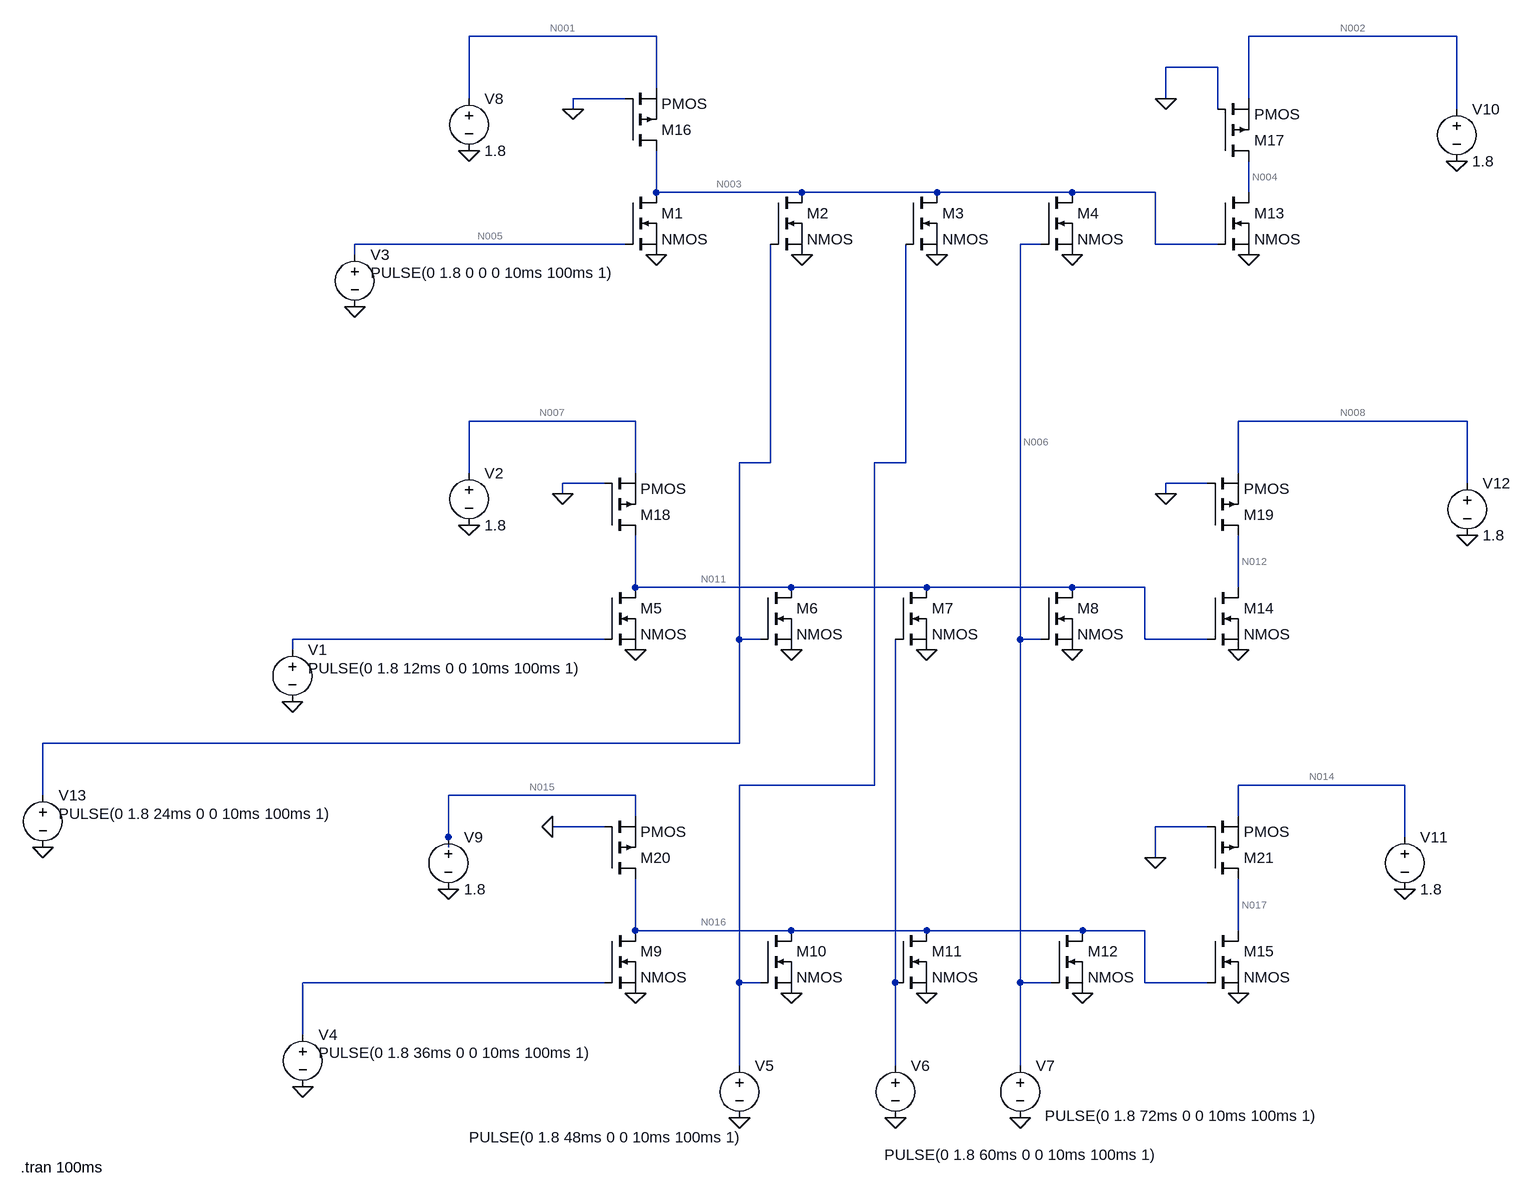
[diagram p0: schematic nmosNF.asc]
nmosNF.asc, the LTspice schematic file:
Version 4
SHEET 1 1140 1792
WIRE -1760 -256 -2048 -256
WIRE -528 -256 -848 -256
WIRE -896 -208 -976 -208
WIRE -1760 -176 -1760 -256
WIRE -2048 -160 -2048 -256
WIRE -1808 -160 -1888 -160
WIRE -976 -160 -976 -208
WIRE -848 -160 -848 -256
WIRE -1888 -144 -1888 -160
WIRE -896 -144 -896 -208
WIRE -528 -144 -528 -256
WIRE -1760 -16 -1760 -80
WIRE -1536 -16 -1760 -16
WIRE -1328 -16 -1536 -16
WIRE -1120 -16 -1328 -16
WIRE -992 -16 -1120 -16
WIRE -848 -16 -848 -64
WIRE -1808 64 -2224 64
WIRE -1168 64 -1200 64
WIRE -992 64 -992 -16
WIRE -896 64 -992 64
WIRE -2224 80 -2224 64
WIRE -1792 336 -2048 336
WIRE -512 336 -864 336
WIRE -1584 400 -1584 64
WIRE -1584 400 -1632 400
WIRE -1376 400 -1376 64
WIRE -1376 400 -1424 400
WIRE -2048 416 -2048 336
WIRE -1792 416 -1792 336
WIRE -864 416 -864 336
WIRE -1840 432 -1904 432
WIRE -912 432 -976 432
WIRE -512 432 -512 336
WIRE -1904 448 -1904 432
WIRE -976 448 -976 432
WIRE -1792 592 -1792 512
WIRE -1552 592 -1792 592
WIRE -1344 592 -1552 592
WIRE -1120 592 -1344 592
WIRE -1008 592 -1120 592
WIRE -864 592 -864 512
WIRE -1792 608 -1792 592
WIRE -1840 672 -2320 672
WIRE -1632 672 -1632 400
WIRE -1600 672 -1632 672
WIRE -1200 672 -1200 64
WIRE -1168 672 -1200 672
WIRE -1008 672 -1008 592
WIRE -912 672 -1008 672
WIRE -2320 688 -2320 672
WIRE -1632 832 -1632 672
WIRE -1632 832 -2704 832
WIRE -1424 896 -1424 400
WIRE -1424 896 -1632 896
WIRE -608 896 -864 896
WIRE -2704 912 -2704 832
WIRE -1792 912 -2080 912
WIRE -1792 944 -1792 912
WIRE -864 944 -864 896
WIRE -1840 960 -1920 960
WIRE -912 960 -992 960
WIRE -2080 976 -2080 912
WIRE -608 976 -608 896
WIRE -2080 992 -2080 976
WIRE -992 1008 -992 960
WIRE -1792 1120 -1792 1040
WIRE -1552 1120 -1792 1120
WIRE -1344 1120 -1552 1120
WIRE -1104 1120 -1344 1120
WIRE -1008 1120 -1104 1120
WIRE -864 1120 -864 1040
WIRE -1840 1200 -2304 1200
WIRE -1632 1200 -1632 896
WIRE -1600 1200 -1632 1200
WIRE -1392 1200 -1392 672
WIRE -1200 1200 -1200 672
WIRE -1152 1200 -1200 1200
WIRE -1008 1200 -1008 1120
WIRE -912 1200 -1008 1200
WIRE -2304 1280 -2304 1200
WIRE -1632 1328 -1632 1200
WIRE -1392 1328 -1392 1200
WIRE -1200 1328 -1200 1200
FLAG -2048 -80 0
FLAG -2224 160 0
FLAG -2048 496 0
FLAG -2320 768 0
FLAG -2704 992 0
FLAG -2080 1056 0
FLAG -2304 1360 0
FLAG -1792 1216 0
FLAG -1632 1408 0
FLAG -1552 1216 0
FLAG -1392 1408 0
FLAG -1200 1408 0
FLAG -1104 1216 0
FLAG -1344 1216 0
FLAG -864 1216 0
FLAG -608 1056 0
FLAG -512 512 0
FLAG -528 -64 0
FLAG -848 80 0
FLAG -1120 80 0
FLAG -1328 80 0
FLAG -1536 80 0
FLAG -1760 80 0
FLAG -1792 688 0
FLAG -1552 688 0
FLAG -1344 688 0
FLAG -1120 688 0
FLAG -1888 -144 0
FLAG -976 -160 0
FLAG -1904 448 0
FLAG -976 448 0
FLAG -1920 960 0
FLAG -992 1008 0
FLAG -864 688 0
SYMBOL nmos -1808 -16 R0
SYMATTR InstName M1
SYMBOL nmos -1584 -16 R0
SYMATTR InstName M2
SYMBOL nmos -1376 -16 R0
SYMATTR InstName M3
SYMBOL nmos -1168 -16 R0
SYMATTR InstName M4
SYMBOL nmos -1840 592 R0
SYMATTR InstName M5
SYMBOL nmos -1600 592 R0
SYMATTR InstName M6
SYMBOL nmos -1392 592 R0
SYMATTR InstName M7
SYMBOL nmos -1168 592 R0
SYMATTR InstName M8
SYMBOL nmos -1840 1120 R0
SYMATTR InstName M9
SYMBOL nmos -1600 1120 R0
SYMATTR InstName M10
SYMBOL nmos -1392 1120 R0
SYMATTR InstName M11
SYMBOL nmos -1152 1120 R0
SYMATTR InstName M12
SYMBOL nmos -896 -16 R0
SYMATTR InstName M13
SYMBOL nmos -912 592 R0
SYMATTR InstName M14
SYMBOL nmos -912 1120 R0
SYMATTR InstName M15
SYMBOL pmos -1808 -80 M180
SYMATTR InstName M16
SYMBOL pmos -896 -64 M180
SYMATTR InstName M17
SYMBOL pmos -1840 512 M180
SYMATTR InstName M18
SYMBOL pmos -912 512 M180
SYMATTR InstName M19
SYMBOL pmos -1840 1040 M180
SYMATTR InstName M20
SYMBOL pmos -912 1040 M180
SYMATTR InstName M21
SYMBOL voltage -2320 672 R0
WINDOW 3 24 44 Left 2
WINDOW 123 0 0 Left 0
WINDOW 39 0 0 Left 0
SYMATTR Value PULSE(0 1.8 12ms 0 0 10ms 100ms 1)
SYMATTR InstName V1
SYMBOL voltage -2048 400 R0
WINDOW 123 0 0 Left 0
WINDOW 39 0 0 Left 0
SYMATTR InstName V2
SYMATTR Value 1.8
SYMBOL voltage -2224 64 R0
WINDOW 3 24 44 Left 2
WINDOW 123 0 0 Left 0
WINDOW 39 0 0 Left 0
SYMATTR Value PULSE(0 1.8 0 0 0 10ms 100ms 1)
SYMATTR InstName V3
SYMBOL voltage -2304 1264 R0
WINDOW 3 24 44 Left 2
WINDOW 123 0 0 Left 0
WINDOW 39 0 0 Left 0
SYMATTR Value PULSE(0 1.8 36ms 0 0 10ms 100ms 1)
SYMATTR InstName V4
SYMBOL voltage -1632 1312 R0
WINDOW 3 5 126 Right 2
WINDOW 123 0 0 Left 0
WINDOW 39 0 0 Left 0
SYMATTR Value PULSE(0 1.8 48ms 0 0 10ms 100ms 1)
SYMATTR InstName V5
SYMBOL voltage -1392 1312 R0
WINDOW 3 -17 153 Left 2
WINDOW 123 0 0 Left 0
WINDOW 39 0 0 Left 0
SYMATTR Value PULSE(0 1.8 60ms 0 0 10ms 100ms 1)
SYMATTR InstName V6
SYMBOL voltage -1200 1312 R0
WINDOW 3 38 93 Left 2
WINDOW 123 0 0 Left 0
WINDOW 39 0 0 Left 0
SYMATTR Value PULSE(0 1.8 72ms 0 0 10ms 100ms 1)
SYMATTR InstName V7
SYMBOL voltage -2048 -176 R0
WINDOW 123 0 0 Left 0
WINDOW 39 0 0 Left 0
SYMATTR InstName V8
SYMATTR Value 1.8
SYMBOL voltage -2080 960 R0
WINDOW 123 0 0 Left 0
WINDOW 39 0 0 Left 0
SYMATTR InstName V9
SYMATTR Value 1.8
SYMBOL voltage -528 -160 R0
WINDOW 123 0 0 Left 0
WINDOW 39 0 0 Left 0
SYMATTR InstName V10
SYMATTR Value 1.8
SYMBOL voltage -608 960 R0
WINDOW 123 0 0 Left 0
WINDOW 39 0 0 Left 0
SYMATTR InstName V11
SYMATTR Value 1.8
SYMBOL voltage -512 416 R0
WINDOW 123 0 0 Left 0
WINDOW 39 0 0 Left 0
SYMATTR InstName V12
SYMATTR Value 1.8
SYMBOL voltage -2704 896 R0
WINDOW 3 24 44 Left 2
WINDOW 123 0 0 Left 0
WINDOW 39 0 0 Left 0
SYMATTR Value PULSE(0 1.8 24ms 0 0 10ms 100ms 1)
SYMATTR InstName V13
TEXT -2738 1484 Left 2 !.tran 100ms

The netlist it stands for:
* nmosNF.asc
M1 N003 N005 0 0 NMOS
M2 N003 N009 0 0 NMOS
M3 N003 N010 0 0 NMOS
M4 N003 N006 0 0 NMOS
M5 N011 N013 0 0 NMOS
M6 N011 N009 0 0 NMOS
M7 N011 N019 0 0 NMOS
M8 N011 N006 0 0 NMOS
M9 N016 N018 0 0 NMOS
M10 N016 N010 0 0 NMOS
M11 N016 N019 0 0 NMOS
M12 N016 N006 0 0 NMOS
M13 N004 N003 0 0 NMOS
M14 N012 N011 0 0 NMOS
M15 N017 N016 0 0 NMOS
M16 N003 0 N001 N001 PMOS
M17 N004 0 N002 N002 PMOS
M18 N011 0 N007 N007 PMOS
M19 N012 0 N008 N008 PMOS
M20 N016 0 N015 N015 PMOS
M21 N017 0 N014 N014 PMOS
V1 N013 0 PULSE(0 1.8 12ms 0 0 10ms 100ms 1)
V2 N007 0 1.8
V3 N005 0 PULSE(0 1.8 0 0 0 10ms 100ms 1)
V4 N018 0 PULSE(0 1.8 36ms 0 0 10ms 100ms 1)
V5 N010 0 PULSE(0 1.8 48ms 0 0 10ms 100ms 1)
V6 N019 0 PULSE(0 1.8 60ms 0 0 10ms 100ms 1)
V7 N006 0 PULSE(0 1.8 72ms 0 0 10ms 100ms 1)
V8 N001 0 1.8
V9 N015 0 1.8
V10 N002 0 1.8
V11 N014 0 1.8
V12 N008 0 1.8
V13 N009 0 PULSE(0 1.8 24ms 0 0 10ms 100ms 1)
.model NMOS NMOS
.model PMOS PMOS
.lib standard.mos
.tran 100ms
.backanno
.end

* Results of the author's LTspice run, read from the files saved beside the schematic
* Operating Point, zero values left out:
*   V(n003) = 1.8 V
*   V(n011) = 1.8 V
*   V(n016) = 1.8 V
*   V(n004) = 900 mV
*   V(n012) = 900 mV
*   V(n017) = 900 mV
*   V(n001) = 1.8 V
*   V(n002) = 1.8 V
*   V(n007) = 1.8 V
*   V(n008) = 1.8 V
*   V(n015) = 1.8 V
*   V(n014) = 1.8 V
*   Id(M1) = 3.61 pA
*   Ib(M1) = -1.81 pA
*   Is(M1) = -1.8 pA
*   Id(M2) = 3.61 pA
*   Ib(M2) = -1.81 pA
*   Is(M2) = -1.8 pA
*   Id(M3) = 3.61 pA
*   Ib(M3) = -1.81 pA
*   Is(M3) = -1.8 pA
*   Id(M4) = 3.61 pA
*   Ib(M4) = -1.81 pA
*   Is(M4) = -1.8 pA
*   Id(M5) = 3.61 pA
*   Ib(M5) = -1.81 pA
*   Is(M5) = -1.8 pA
*   Id(M6) = 3.61 pA
*   Ib(M6) = -1.81 pA
*   Is(M6) = -1.8 pA
*   Id(M7) = 3.61 pA
*   Ib(M7) = -1.81 pA
*   Is(M7) = -1.8 pA
*   Id(M8) = 3.61 pA
*   Ib(M8) = -1.81 pA
*   Is(M8) = -1.8 pA
*   Id(M9) = 3.61 pA
*   Ib(M9) = -1.81 pA
*   Is(M9) = -1.8 pA
*   Id(M10) = 3.61 pA
*   Ib(M10) = -1.81 pA
*   Is(M10) = -1.8 pA
*   Id(M11) = 3.61 pA
*   Ib(M11) = -1.81 pA
*   Is(M11) = -1.8 pA
*   Id(M12) = 3.61 pA
*   Ib(M12) = -1.81 pA
*   Is(M12) = -1.8 pA
*   Id(M13) = 24.3 µA
*   Is(M13) = -24.3 µA
*   Id(M14) = 24.3 µA
*   Is(M14) = -24.3 µA
*   Id(M15) = 24.3 µA
*   Is(M15) = -24.3 µA
*   Id(M16) = -14.44 pA
*   Is(M16) = 14.44 pA
*   Id(M17) = -24.3 µA
*   Is(M17) = 24.3 µA
*   Id(M18) = -14.44 pA
*   Is(M18) = 14.44 pA
*   Id(M19) = -24.3 µA
*   Is(M19) = 24.3 µA
*   Id(M20) = -14.44 pA
*   Is(M20) = 14.44 pA
*   Id(M21) = -24.3 µA
*   Is(M21) = 24.3 µA
*   I(V2) = -14.44 pA
*   I(V8) = -14.44 pA
*   I(V9) = -14.44 pA
*   I(V10) = -24.3 µA
*   I(V11) = -24.3 µA
*   I(V12) = -24.3 µA
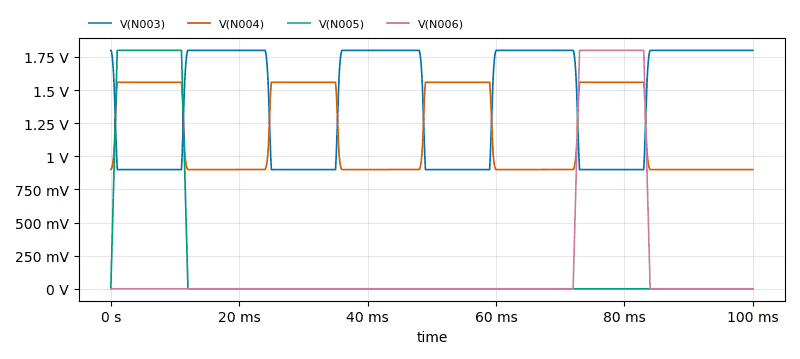
[diagram p1: Transient Analysis of nmosNF.asc, plotted from the saved traces]
* Transient Analysis, 1 run:
*   V(N003): min 900 mV, max 1.8 V, average 1.413 V, rms 1.479 V, last 1.8 V
*   V(N004): min 899.9 mV, max 1.559 V, average 1.182 V, rms 1.225 V, last 900 mV
*   V(N005): min 0 V, max 1.8 V, average 198 mV, rms 588 mV, last 0 V
*   V(N006): min 0 V, max 1.8 V, average 198 mV, rms 588 mV, last 0 V